# EAGLE design ov965x (EAGLE 6.1)
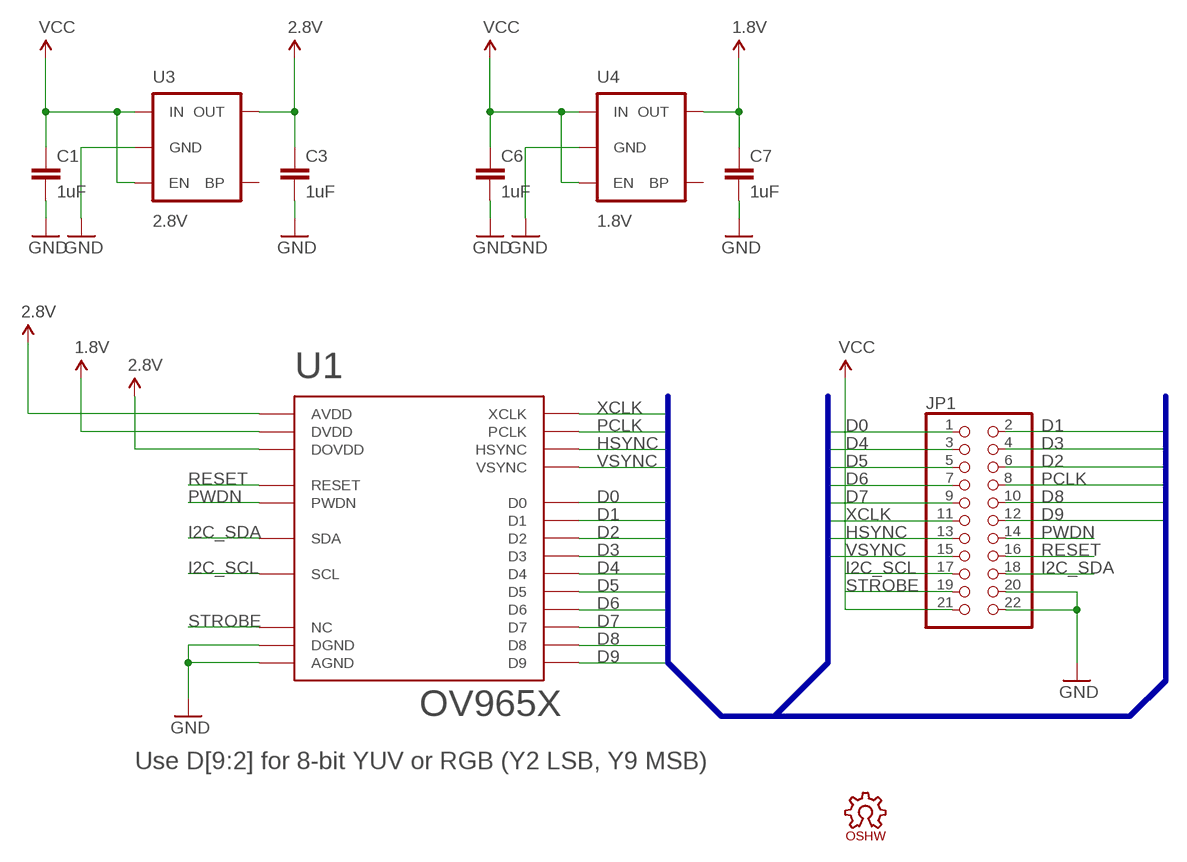
[diagram p0: schematic, sheet 1]

## Parts
C1  1uF  CAP0402-CAP  [0402-CAP]
C3  1uF  CAP0402-CAP  [0402-CAP]
C6  1uF  CAP0402-CAP  [0402-CAP]
C7  1uF  CAP0402-CAP  [0402-CAP]
JP1  PINHD-2X11  [2X11]
LOGO1  OSHW_LOGO_6MILX0150-NT  [OSHW_6X150_NOTEXT]
U1  OV965X  [OV965X]
U3  2.8V  V_REG_LDOSMD  [SOT23-5]
U4  1.8V  V_REG_LDOSMD  [SOT23-5]

## Nets
1.8V: C7.1 U1.P$10(DVDD) U4.5(OUT)
2.8V: C3.1 U1.P$4(AVDD) U1.P$11(DOVDD) U3.5(OUT)
D0: JP1.1 U1.P$24(D0)
D1: JP1.2 U1.P$23(D1)
D2: JP1.6 U1.P$19(D2)
D3: JP1.4 U1.P$21(D3)
D4: JP1.3 U1.P$22(D4)
D5: JP1.5 U1.P$20(D5)
D6: JP1.7 U1.P$18(D6)
D7: JP1.9 U1.P$16(D7)
D8: JP1.10 U1.P$14(D8)
D9: JP1.12 U1.P$12(D9)
GND: C1.2 C3.2 C6.2 C7.2 JP1.20 JP1.22 U1.P$2(AGND) U1.P$15(DGND) U3.2(GND) U4.2(GND)
HSYNC: JP1.13 U1.P$9(HSYNC)
I2C_SCL: JP1.17 U1.P$5(SCL)
I2C_SDA: JP1.18 U1.P$3(SDA)
PCLK: JP1.8 U1.P$17(PCLK)
PWDN: JP1.14 U1.P$8(PWDN)
RESET: JP1.16 U1.P$6(RESET)
STROBE: JP1.19 U1.P$1(NC)
VCC: C1.1 C6.1 JP1.21 U3.1(IN) U3.3(EN) U4.1(IN) U4.3(EN)
VSYNC: JP1.15 U1.P$7(VSYNC)
XCLK: JP1.11 U1.P$13(XCLK)
Unconnected: U3.4(BP) U4.4(BP)

## Buses
D[0..9],XCLK,PCLK,HSYNC,VSYNC

## Notes on the sheet
- Use D[9:2] for 8-bit YUV or RGB (Y2 LSB, Y9 MSB)

## Library data of the parts
C1 C3 C6 C7 = sfe:CAP: Capacitor Standard 0603 ceramic capacitor, and 0.1" leaded capacitor.
JP1 = pinhead:PINHD-2X11: PIN HEADER
LOGO1 = iofault:OSHW_LOGO_6MIL
U1 = OV965x:OV965X
U3 U4 = SparkFun:V_REG_LDO: Voltage Regulator LDO Standard 150mA LDO voltage regulator in SOT-23 layout. Micrel part MIC5205. BP (by-pass) pin is used to lower output noise with 470pF cap.

## Board
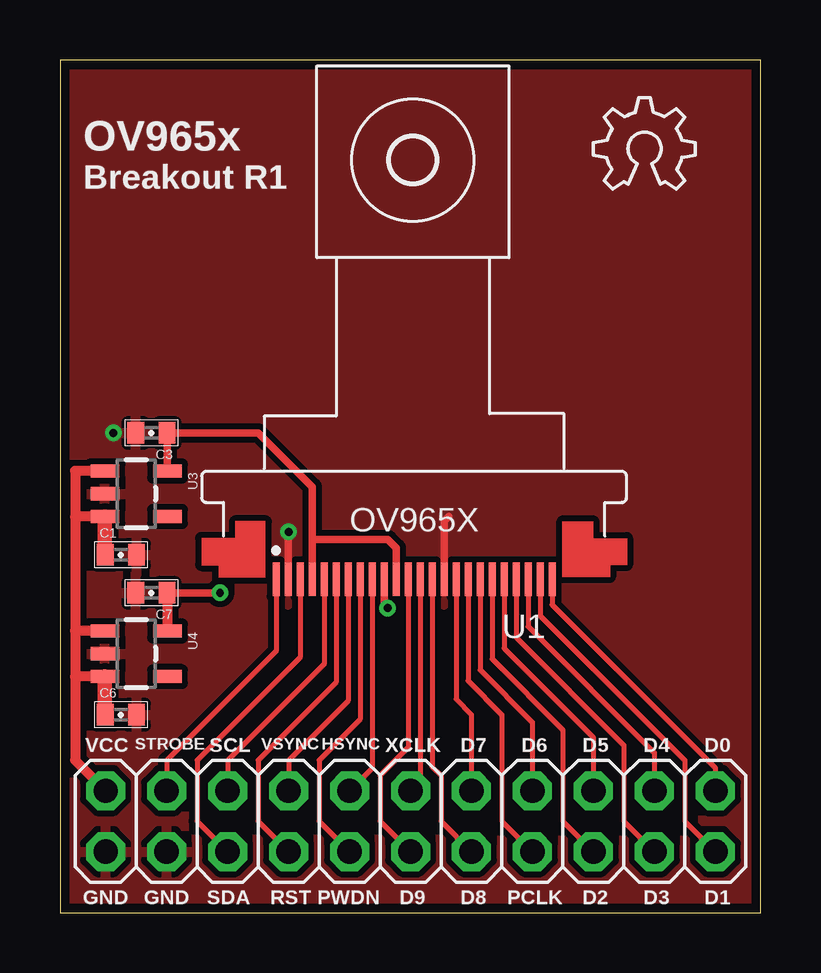
[diagram p1: board, top side]
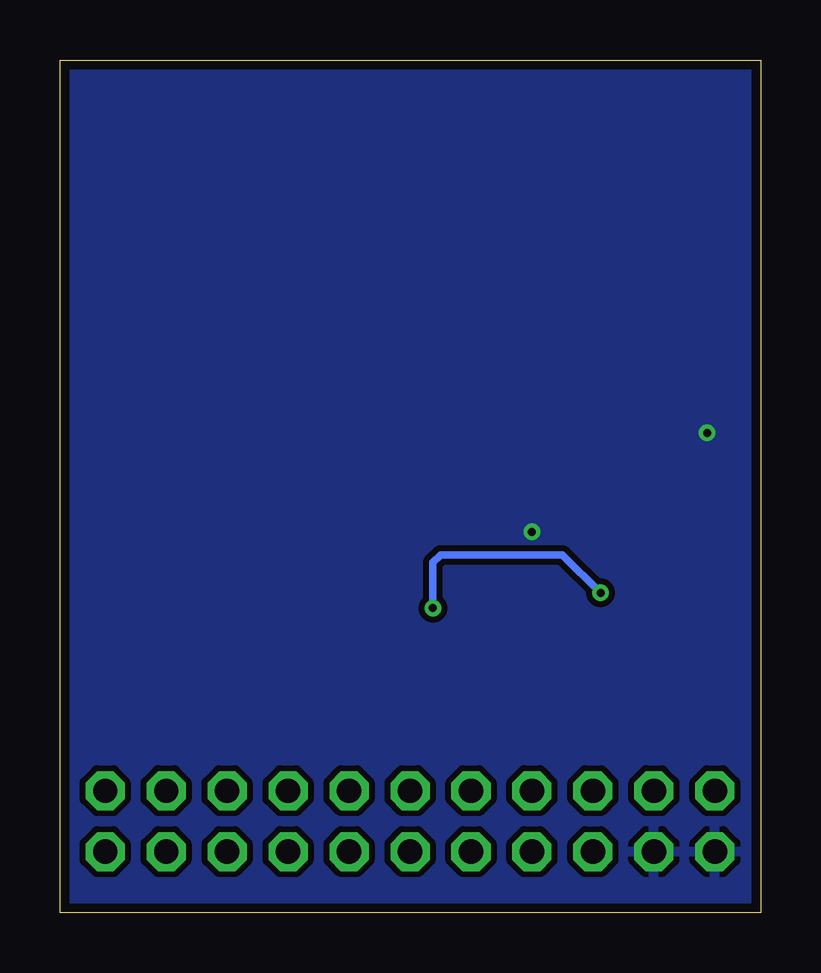
[diagram p2: board, bottom side, seen from below]

Size 29.19 x 35.55 mm. Coordinates in mm from the lower left corner, seen from the top.
Outline: 0,0 29.19,0 29.19,35.55 0,35.55 0,0
Copper layers (1*16): Top 0.0356mm / dielectric 1.5011mm / Bottom 0.0356mm
Design rules: minimum track width 6mil, minimum drill 13mil, track to track 6mil, track to pad 6mil, pad to pad 6mil, via to via 6mil, smd to smd 6mil, copper to edge 15mil, drill to drill 6mil, minimum pad ring 12mil, minimum via ring 7mil, stop-mask expansion 2mil, vias tented up to drill 13mil, thermal gap 10mil

### Footprints (pad centres in the part's own frame; a part is rotated, then mirrored left to right if it is on the bottom)
0402-CAP = smd 0.7 x 0.9: 1 -0.65,0; 2 0.65,0
2X11 = drill 1.016 octagon: 1 -12.7,-1.27; 2 -12.7,1.27; 3 -10.16,-1.27; 4 -10.16,1.27; 5 -7.62,-1.27; 6 -7.62,1.27; 7 -5.08,-1.27; 8 -5.08,1.27; 9 -2.54,-1.27; 10 -2.54,1.27; 11 0,-1.27; 12 0,1.27; 13 2.54,-1.27; 14 2.54,1.27; 15 5.08,-1.27; 16 5.08,1.27; 17 7.62,-1.27; 18 7.62,1.27; 19 10.16,-1.27; 20 10.16,1.27; 21 12.7,-1.27; 22 12.7,1.27
OV965X = smd 0.3 x 1.4: P$1 -5.6,-11.5; P$2 -5.1,-11.5; P$3 -4.6,-11.5; P$4 -4.1,-11.5; P$5 -3.6,-11.5; P$6 -3.1,-11.5; P$7 -2.6,-11.5; P$8 -2.1,-11.5; P$9 -1.6,-11.5; P$10 -1.1,-11.5; P$11 -0.6,-11.5; P$12 -0.1,-11.5; P$13 0.4,-11.5; P$14 0.9,-11.5; P$15 1.4,-11.5; P$16 1.9,-11.5; P$17 2.4,-11.5; P$18 2.9,-11.5; P$19 3.4,-11.5; P$20 3.9,-11.5; P$21 4.4,-11.5; P$22 4.9,-11.5; P$23 5.4,-11.5; P$24 5.9,-11.5
SOT23-5 = smd 0.55 x 1.2: 1 -0.95,-1.3; 2 0,-1.3; 3 0.95,-1.3; 4 0.95,1.3; 5 -0.95,1.3

### Placement (x,y rotation side)
C1  2.54,14.92 0 top
C3  3.81,20 180 top
C6  2.54,8.26 0 top
C7  3.81,13.34 180 top
JP1  14.61,3.81 180 top
LOGO1  22.23,30.16 0 top
U1  14.61,25.4 0 top
U3  3.17,17.46 270 top
U4  3.17,10.79 270 top

### Tracks (layer width: path | path; a pad name or v marks a point on that pad's centre or on a via)
1.8V  (via drill 0.33)
  Top 0.305: C7.1 v6.67,13.34 | U1.P$10 13.51,12.85 v13.65,12.7
  Top 0.406: C7.1 4.46,11.76 U4.5
  Bottom 0.305: v6.67,13.34 8.26,14.92 13.34,14.92 13.65,14.61 v13.65,12.7
2.8V
  Top 0.305: U3.5 4.47,19.99 | C3.1 8.26,20 10.51,17.75 10.51,15.56 | U1.P$4 10.51,15.56 | U1.P$11 14.01,15.21 13.65,15.56 10.51,15.56
  Top 0.61: 4.47,19.99 C3.1
D0
  Top 0.203: U1.P$24 20.5,12.83 27.3,6.03 JP1.1
D1
  Top 0.203: U1.P$23 20,12.38 26.04,6.35 26.04,3.81 JP1.2
D2
  Top 0.203: U1.P$19 18,10.57 20.95,7.62 20.95,3.81 JP1.6
D3
  Top 0.203: U1.P$21 19,11.47 23.5,6.99 23.5,3.81 JP1.4
D4
  Top 0.203: U1.P$22 19.5,11.93 24.77,6.67 JP1.3
D5
  Top 0.203: U1.P$20 18.5,11.02 22.23,7.3 JP1.5
D6
  Top 0.203: U1.P$18 17.5,10.12 19.68,7.94 JP1.7
D7
  Top 0.203: U1.P$16 16.5,8.89 17.14,8.26 JP1.9
D8
  Top 0.203: U1.P$14 15.51,6.08 15.88,5.71 15.88,3.81 JP1.10
D9
  Top 0.203: U1.P$12 14.51,6.88 13.34,5.71 13.34,3.81 JP1.12
GND  (via drill 0.33)
  Top 0.305: U1.P$15 16,16.32 16.19,16.51 | U1.P$2 9.51,15.86 v9.53,15.88
  other vias: 2.22,20
  pour Bottom (isolate 0.254): 0,0 0,35.56 29.21,35.56 29.21,0
  pour Top (isolate 0.254): 0,0 0,35.56 29.21,35.56 29.21,0
HSYNC
  Top 0.203: U1.P$9 13.01,6.02 JP1.13
I2C_SCL
  Top 0.203: U1.P$5 11.01,10.37 6.99,6.35 JP1.17
I2C_SDA
  Top 0.203: U1.P$3 10.01,10.64 5.71,6.35 5.71,3.81 JP1.18
PCLK
  Top 0.203: U1.P$17 17,9.66 18.41,8.26 18.41,3.81 JP1.8
PWDN
  Top 0.203: U1.P$8 12.51,8.06 10.79,6.35 10.79,3.81 JP1.14
RESET
  Top 0.203: JP1.16 8.26,3.81 8.26,6.35 11.51,9.6 U1.P$6
STROBE
  Top 0.203: U1.P$1 9.01,10.91 4.45,6.35 JP1.19
VCC
  Top 0.406: U3.3 0.64,16.51 | JP1.21 0.64,6.35 0.64,9.84 | 0.64,16.51 0.64,11.75 | 0.64,11.75 0.64,9.84 | U4.3 0.64,9.85 0.64,9.84 | U4.1 0.64,11.74 0.64,11.75 | U3.1 0.64,18.41 0.64,16.51
  Top 0.61: U4.3 1.88,8.26 C6.1 | U3.3 1.88,14.92 C1.1
VSYNC
  Top 0.203: U1.P$7 12.01,8.83 9.53,6.35 JP1.15
XCLK
  Top 0.203: U1.P$13 15.01,5.48 JP1.11

### Text on the board
tPlace: OV965x | Breakout R1 | VCC | STROBE | SCL | VSYNC | HSYNC | XCLK | D7 | D6 | D5 | D4 | D0 | GND | GND | SDA | RST | PWDN | D9 | D8 | PCLK | D2 | D3 | D1